# EAGLE design LTC3115 - przetwornica wiatrak (EAGLE 6.3)
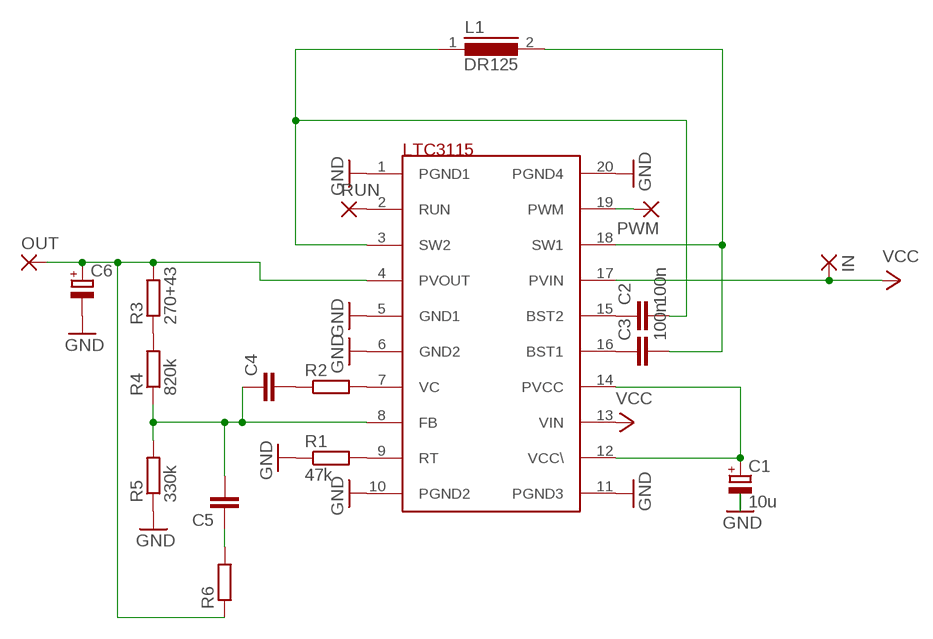
[diagram p0: schematic, sheet 1]

## Parts
C1  10u  CPOL-EUE2.5-7  [E2,5-7]
C2  100n  C-EUC0805  [C0805]
C3  100n  C-EUC0805  [C0805]
C4  C-EUC0805  [C0805]
C5  C-EUC0805  [C0805]
C6  CPOL-EUE3.5-8  [E3,5-8]
IN  2,54/0,9  [2,54/0,9]
L1  DR125  [DR125]
OUT  2,54/0,9  [2,54/0,9]
PWM  2,54/0,9  [2,54/0,9]
R1  47k  R-EU_R0805  [R0805]
R2  R-EU_R0805  [R0805]
R3  270+43  R-EU_R0805  [R0805]
R4  820k  R-EU_R0805  [R0805]
R5  330k  R-EU_R0805  [R0805]
R6  R-EU_R0805  [R0805]
RUN  2,54/0,9  [2,54/0,9]
U$1  LTC3115  [TSSOP20]

## Nets
GND: C1.- C6.- R1.1 R5.1 U$1.1(PGND1) U$1.5(GND1) U$1.6(GND2) U$1.10(PGND2) U$1.11(PGND3) U$1.20(PGND4)
N$1: C1.+ U$1.12(VCC\) U$1.14(PVCC)
N$2: R1.2 U$1.9(RT)
N$3: R2.2 U$1.7(VC)
N$4: C4.1 C5.2 R4.1 R5.2 U$1.8(FB)
N$5: R3.1 R4.2
N$6: C6.+ OUT.1(P) R3.2 R6.1 U$1.4(PVOUT)
N$7: C2.1 U$1.15(BST2)
N$8: C3.1 U$1.16(BST1)
N$9: C4.2 R2.1
N$10: PWM.1(P) U$1.19(PWM)
N$11: RUN.1(P) U$1.2(RUN)
N$12: C2.2 L1.1 U$1.3(SW2)
N$13: C3.2 L1.2 U$1.18(SW1)
N$14: C5.1 R6.2
VCC: IN.1(P) U$1.13(VIN) U$1.17(PVIN)

## Library data of the parts
C1 C6 = rcl:CPOL-EU: POLARIZED CAPACITOR, European symbol
C2-C5 = rcl:C-EU: CAPACITOR, European symbol
IN OUT PWM RUN = wirepad:2,54/0,9: THROUGH-HOLE PAD
L1 = inductors:DR125: High Power Density, High Efficiency, Shielded Inductors Source: coiltronics_dr_series.pdf
R1-R6 = rcl:R-EU_: RESISTOR, European symbol
U$1 = ref-packages:LTC3115: 40V, 2A Synchronous Buck-Boost DC/DC Converter

## Net classes
0 default: clearance 0.7 mm

## Board
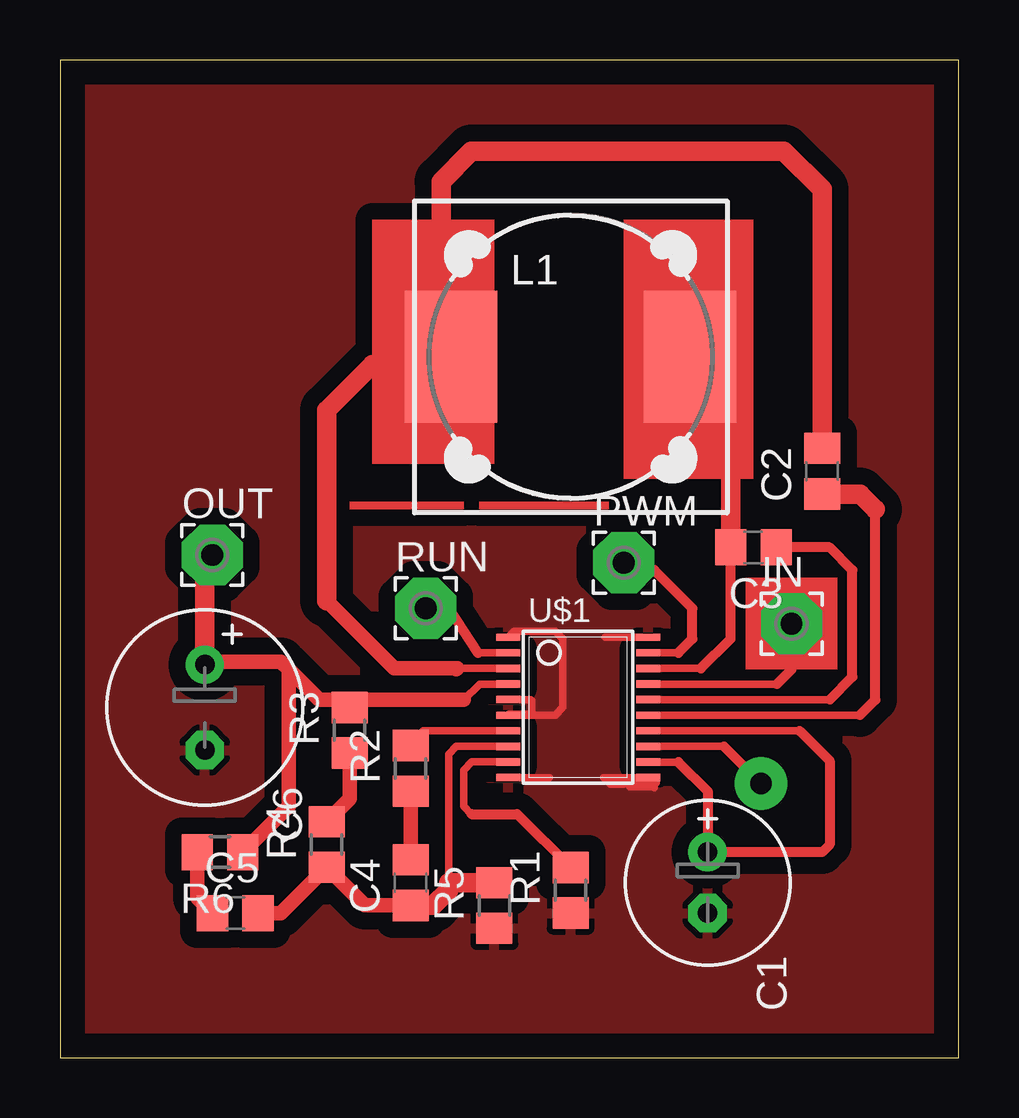
[diagram p1: board, top side]
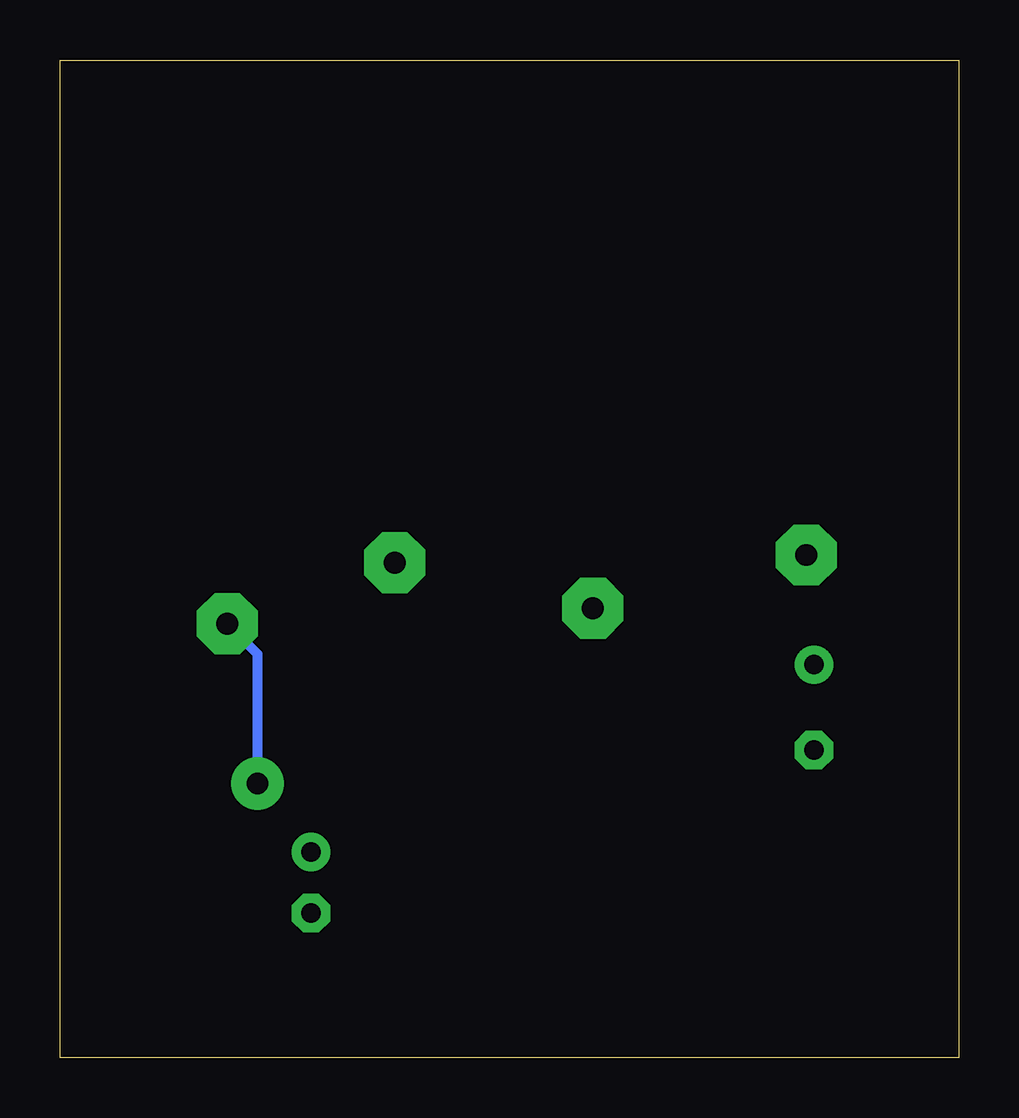
[diagram p2: board, bottom side, seen from below]

Size 37.44 x 41.58 mm. Coordinates in mm from the lower left corner, seen from the top.
Outline: 0,0 37.44,0 37.44,41.58 0,41.58 0,0
Copper layers (1*16): Top 0.035mm / dielectric 1.5mm / Bottom 0.035mm
Design rules "default": minimum track width 10mil, minimum drill 24mil, track to track 8mil, track to pad 8mil, pad to pad 8mil, via to via 8mil, smd to smd 8mil, copper to edge 40mil, drill to drill 8mil, minimum pad ring 10mil, minimum via ring 8mil, stop-mask expansion 4mil, vias tented up to drill 0mil, thermal gap 10mil

### Footprints (pad centres in the part's own frame; a part is rotated, then mirrored left to right if it is on the bottom)
E2,5-7 = drill 0.813 pad 1.6: + -1.27,0 | drill 0.813 pad 1.6 octagon: - 1.27,0
C0805 = smd 1.3 x 1.5: 1 -0.95,0; 2 0.95,0
E3,5-8 = drill 0.813 pad 1.6: + -1.778,0 | drill 0.813 pad 1.6 octagon: - 1.778,0
2,54/0,9 = drill 0.914 pad 2.54 octagon: 1 0,0
DR125 = smd 3.85 x 5.5: 1 -4.975,0; 2 4.975,0
R0805 = smd 1.3 x 1.5: 1 -0.95,0; 2 0.95,0
TSSOP20 = smd 0.305 x 0.991: 1 -2.925,-2.918; 2 -2.275,-2.918; 3 -1.625,-2.918; 4 -0.975,-2.918; 5 -0.325,-2.918; 6 0.325,-2.918; 7 0.975,-2.918; 8 1.625,-2.918; 9 2.275,-2.918; 10 2.925,-2.918; 11 2.925,2.918; 12 2.275,2.918; 13 1.625,2.918; 14 0.975,2.918; 15 0.325,2.918; 16 -0.325,2.918; 17 -0.975,2.918; 18 -1.625,2.918; 19 -2.275,2.918; 20 -2.925,2.918

### Placement (x,y rotation side)
C1  26.99,7.3 270 top
C2  31.75,24.45 90 top
C3  28.89,21.27 180 top
C4  14.6,7.3 90 top
C5  7.3,6.03 0 top
C6  6.03,14.61 270 top
IN  30.48,18.1 0 top
L1  21.27,29.21 0 top
OUT  6.35,20.96 0 top
PWM  23.49,20.64 0 top
R1  21.27,6.99 90 top
R2  14.6,12.07 90 top
R3  12.06,13.65 90 top
R4  11.11,8.89 90 top
R5  18.1,6.35 90 top
R6  6.67,8.57 180 top
RUN  15.24,18.73 0 top
U$1  21.59,14.61 270 top

### Tracks (layer width: path | path; a pad name or v marks a point on that pad's centre or on a via)
GND
  Top 0.305: U$1.1 18.92,17.78 20.64,17.78 20.95,17.46 20.95,14.61 20.63,14.28 U$1.6 18.7,14.31 19.66,14.31 19.66,14.32 19.66,14.88 19.6,14.93 U$1.5 | U$1.20 22.71,17.53 22.71,17.52 22.74,17.53 | U$1.10 20.39,11.68 | U$1.11 22.66,11.68 22.94,11.4 23.46,11.4 23.52,11.46 24.84,11.46 24.76,11.38 24.76,11.26 24.73,11.29 23.73,11.29
  pour Top: -36.2,-20.64 54.61,-19.68 54.61,46.36 -36.2,45.4
N$1
  Top 0.305: U$1.12 25.77,12.33 | U$1.14 30.82,13.63
  Top 0.406: 25.77,12.33 26.99,11.11 C1.+ 31.75,8.57 32.07,8.89 32.07,12.38 30.82,13.63
N$2
  Top 0.305: U$1.9 17.16,12.33 16.83,11.99 16.83,10.48 17.15,10.16 | R1.2
  Top 0.406: 17.15,10.16 19.05,10.16 R1.2
N$3
  Top 0.305: U$1.7 15.14,13.63 14.6,13.09 R2.2
N$4
  Top 0.305: U$1.8 16.51,12.98 16.19,12.66 16.19,7.3 | R5.2
  Top 0.61: C4.1 12.7,6.35 R4.1 9.2,6.03 C5.2
  Top 0.813: C4.1 15.56,6.35 16.19,6.99 16.19,7.3 R5.2
N$5
  Top 0.61: R4.2 12.06,10.79 R3.1
N$6
  Top 0.305: U$1.4 17.48,15.58 16.83,14.92
  Top 0.406: R3.2 12.06,14.92
  Top 0.61: 16.83,14.92 12.06,14.92 10.8,14.92 9.52,16.19 | 9.52,16.19 9.21,16.51 6.16,16.51 C6.+ | 6.02,20.83 OUT.1 | R6.1 9.52,10.48 9.52,16.19
  Top 0.813: C6.+ 6.02,20.83
N$7
  Top 0.305: U$1.15 33.33,14.28
  Top 0.406: 33.33,14.28 33.97,14.92 33.97,22.86 | C2.1
  Top 0.813: 33.97,22.86 33.34,23.5 C2.1
N$8
  Top 0.305: U$1.16 32.08,14.93
  Top 0.406: 32.08,14.93 33.02,15.88 33.02,20.32 32.07,21.27 C3.1
N$9
  Top 0.61: C4.2 R2.1
N$10
  Top 0.305: U$1.19 25.77,16.88
  Top 0.406: 25.77,16.88 26.35,17.46 26.35,18.73 24.77,20.32 23.81,20.32 PWM.1
N$11
  Top 0.305: U$1.2 17.41,16.88
  Top 0.406: 17.41,16.88 16.19,18.73 RUN.1
N$12
  Top 0.305: U$1.3 16.55,16.23
  Top 0.406: 15.98,28.89 L1.1 15.88,29.63
  Top 0.61: 11.11,19.05 13.93,16.23 16.47,16.23 16.51,16.19 16.55,16.23
  Top 0.813: 11.11,19.05 11.11,26.99 13.02,28.89 15.98,28.89 | C2.2 31.75,36.2 30.16,37.78 17.15,37.78 15.88,36.51 15.88,29.63
N$13
  Top 0.305: U$1.18 26.71,16.23
  Top 0.406: 26.71,16.23 27.94,17.46 C3.2 | 27.94,27.52 L1.2
  Top 0.813: C3.2 27.94,27.52
N$14
  Top 0.61: C5.1 5.72,6.67 5.72,6.99 R6.2
VCC  (via drill 0.9 pad 2.18)
  Top 0.305: U$1.17 29.87,15.58 | U$1.13 27.66,12.98
  Top 0.406: 29.87,15.58 30.48,16.19 IN.1 | 27.66,12.98 v29.21,11.43
  Bottom 0.406: v29.21,11.43 29.21,16.83 IN.1
(copper drawn outside any net)
  shapes: Top area x5